# Altium schematic sheet main.SchDoc
size A
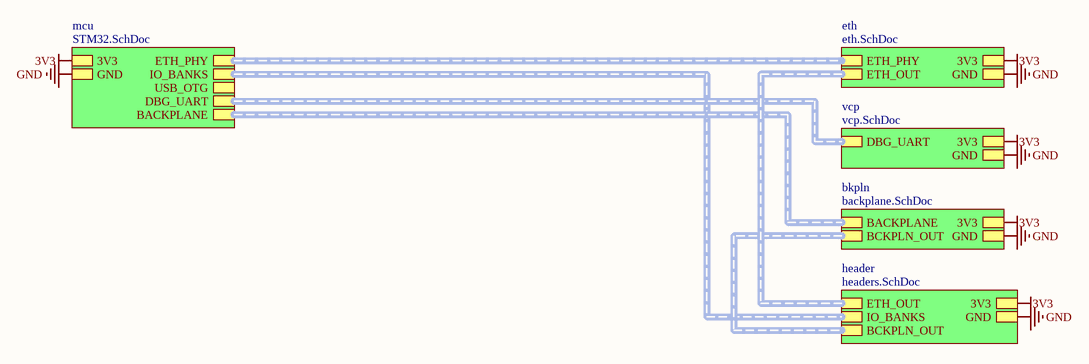
[diagram p0: main.SchDoc]

## Sub-sheets
bkpln = backplane.SchDoc: 3V3, GND, BACKPLANE (harness BACKPLANE), BCKPLN_OUT (harness BCKPLN_OUT)
eth = eth.SchDoc: ETH_PHY (harness ETH_PHY), 3V3, GND, ETH_OUT (harness ETH_OUT)
header = headers.SchDoc: ETH_OUT (harness ETH_OUT), IO_BANKS (harness IO_BANKS), 3V3, GND, BCKPLN_OUT (harness BCKPLN_OUT)
mcu = STM32.SchDoc: BACKPLANE (harness BACKPLANE), ETH_PHY (harness ETH_PHY), IO_BANKS (harness IO_BANKS), USB_OTG (harness USB_OTG), DBG_UART (harness UART), 3V3, GND
vcp = vcp.SchDoc: 3V3, GND, DBG_UART (harness UART)

## Nets
3V3: sheet mcu/3V3, sheet eth/3V3, sheet vcp/3V3, sheet bkpln/3V3, sheet header/3V3
GND: sheet mcu/GND, sheet eth/GND, sheet vcp/GND, sheet bkpln/GND, sheet header/GND

## Buses and harness runs
harness sheet bkpln/BACKPLANE = sheet mcu/BACKPLANE
harness sheet bkpln/BCKPLN_OUT = sheet header/BCKPLN_OUT
harness sheet eth/ETH_OUT = sheet header/ETH_OUT
harness sheet eth/ETH_PHY = sheet mcu/ETH_PHY
harness sheet header/IO_BANKS = sheet mcu/IO_BANKS
harness sheet mcu/DBG_UART = sheet vcp/DBG_UART